# Altium schematic sheet redresseur.SchDoc
size A4; SheetNumber: 4; SheetTotal: 4; SPICEModelCacheDPEDDXIH: <root> / <DocumentId>DPEDDXIH</DocumentId> / <CacheFrame Number="0"> / <Model Name="ideal" Kind="CKT"> / <Text>*IDEAL:Amplificateur operationnel avec gain boucle ouverte de 100K / .SUBCKT IDEAL 1 2 3 / EGAIN 3 0 1 2 1E5 / .ENDS</Text> / </Model> / <Model Name="1n914" Kind="MDL"> / <Text>.model 1N914 D(Is=0.1p Rs=16 CJO=2p Tt=12n Bv=100 Ibv=0.1p)</Text> / </Model> / </CacheFrame> / </root>
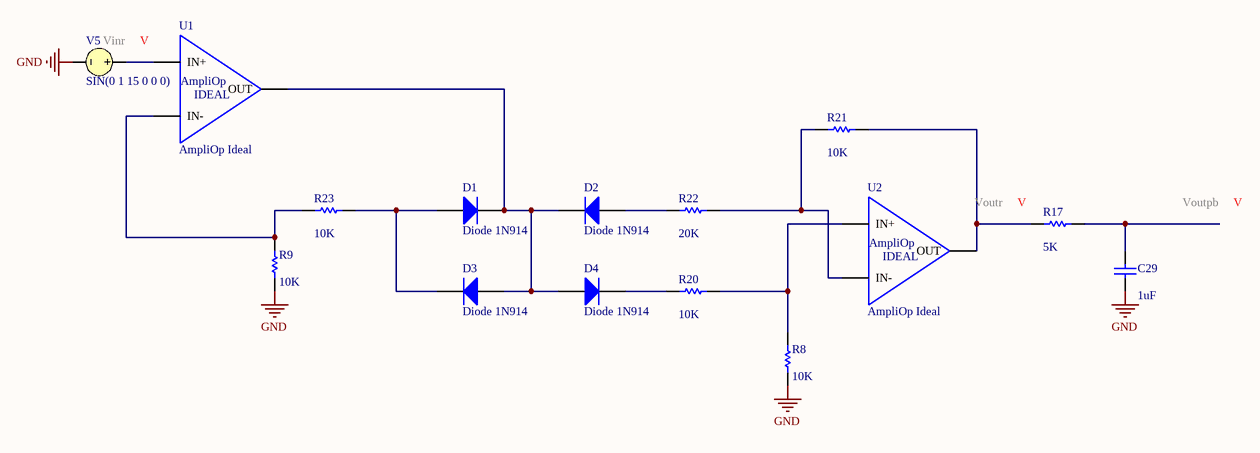
[diagram p0: redresseur.SchDoc]

## Parts
C29  value 1uF  [RAD-0.3]  (hidden comment: Cap)
D1  Diode 1N914  [DO-35]
D2  Diode 1N914  [DO-35]
D3  Diode 1N914  [DO-35]
D4  Diode 1N914  [DO-35]
R8  value 10K  [AXIAL-0.3]  (hidden comment: Res1)
R9  value 10K  [AXIAL-0.3]  (hidden comment: Res1)
R17  value 5K  [AXIAL-0.3]  (hidden comment: Res1)
R20  value 10K  [AXIAL-0.3]  (hidden comment: Res1)
R21  value 10K  [AXIAL-0.3]  (hidden comment: Res1)
R22  value 20K  [AXIAL-0.3]  (hidden comment: Res1)
R23  value 10K  [AXIAL-0.3]  (hidden comment: Res1)
U1  AmpliOp Ideal
U2  AmpliOp Ideal
V5  SIN(0 1 15 0 0 0)

## Nets
GND: C29.1 R8.1 R9.1 V5.2
NetC29_2: C29.2 R17.2
NetD1_1: D1.1(A) D3.2(K) R23.2
NetD1_2: D1.2(K) D2.2(K) D3.1(A) D4.1(A) U1.3(OUT)
NetD2_1: D2.1(A) R22.1
NetD4_2: D4.2(K) R20.1
NetR8_2: R8.2 R20.2 U2.1(IN+)
NetR9_2: R9.2 R23.1 U1.2(IN-)
NetR17_1: R17.1 R21.2 U2.3(OUT)
NetR21_1: R21.1 R22.2 U2.2(IN-)
NetU1_1: U1.1(IN+) V5.1

## Notes on the sheet
- (in symbol AmpliOp_ideal) AmpliOp; IDEAL

## Library data of the parts
C29 = Cap: Capacitor; Published: 8-Jun-2000; LatestRevisionDate: 17-Jul-2002; LatestRevisionNote: Re-released for DXP Platform.; PackageReference: RAD-0.3; Publisher: Altium Limited; PackageDescription: Radial Cap, Thru-Hole; 2 Leads; 0.3 in Pin Spacing
D1-D4 = Diode 1N914: High Conductance Fast Diode; Published: 8-Jun-2000; LatestRevisionDate: 17-Jul-2002; LatestRevisionNote: Re-released for DXP Platform.; DatasheetVersion: 1997; PackageReference: DO-35; Publisher: Altium Limited; PackageDescription: Diode, Axial; Body 3.8 x 1.9 mm (LxDia. max), Lead Dia. 0.53 mm (max); Code_JEDEC: DO-204-AH; ComponentLink1Description: Manufacturer Link; ComponentLink1URL: http://www.fairchildsemi.com/; ComponentLink2Description: Datasheet; ComponentLink2URL: http://www.fairchildsemi.com/ds/1N%2F1N4448.pdf
R8 R9 R17 R20-R23 = Res1: Resistor; Published: 8-Jun-2000; LatestRevisionDate: 17-Jul-2002; LatestRevisionNote: Re-released for DXP Platform.; PackageReference: AXIAL-0.3; Publisher: Altium Limited; PackageDescription: Axial Device, Thru-Hole; 2 Leads; 0.3 in Pin Spacing
U1 U2 = AmpliOp_ideal
V5 = VSRC: Voltage Source; Note: PCB Footprint - Not required; DC Magnitude: 0; AC Magnitude: 1; Frequency: 15; Published: 8-Jun-2000; LatestRevisionDate: 17-Jul-2002; LatestRevisionNote: Re-released for DXP Platform.; PackageReference: Not Applicable; Publisher: Altium Limited; AC Phase: 0; Offset: 0; Amplitude: 1; Delay: 0; Damping Factor: 0; Phase: 0